# Altium schematic sheet MPU PWR.SchDoc
size A4; SheetNumber: 13; SheetTotal: 14
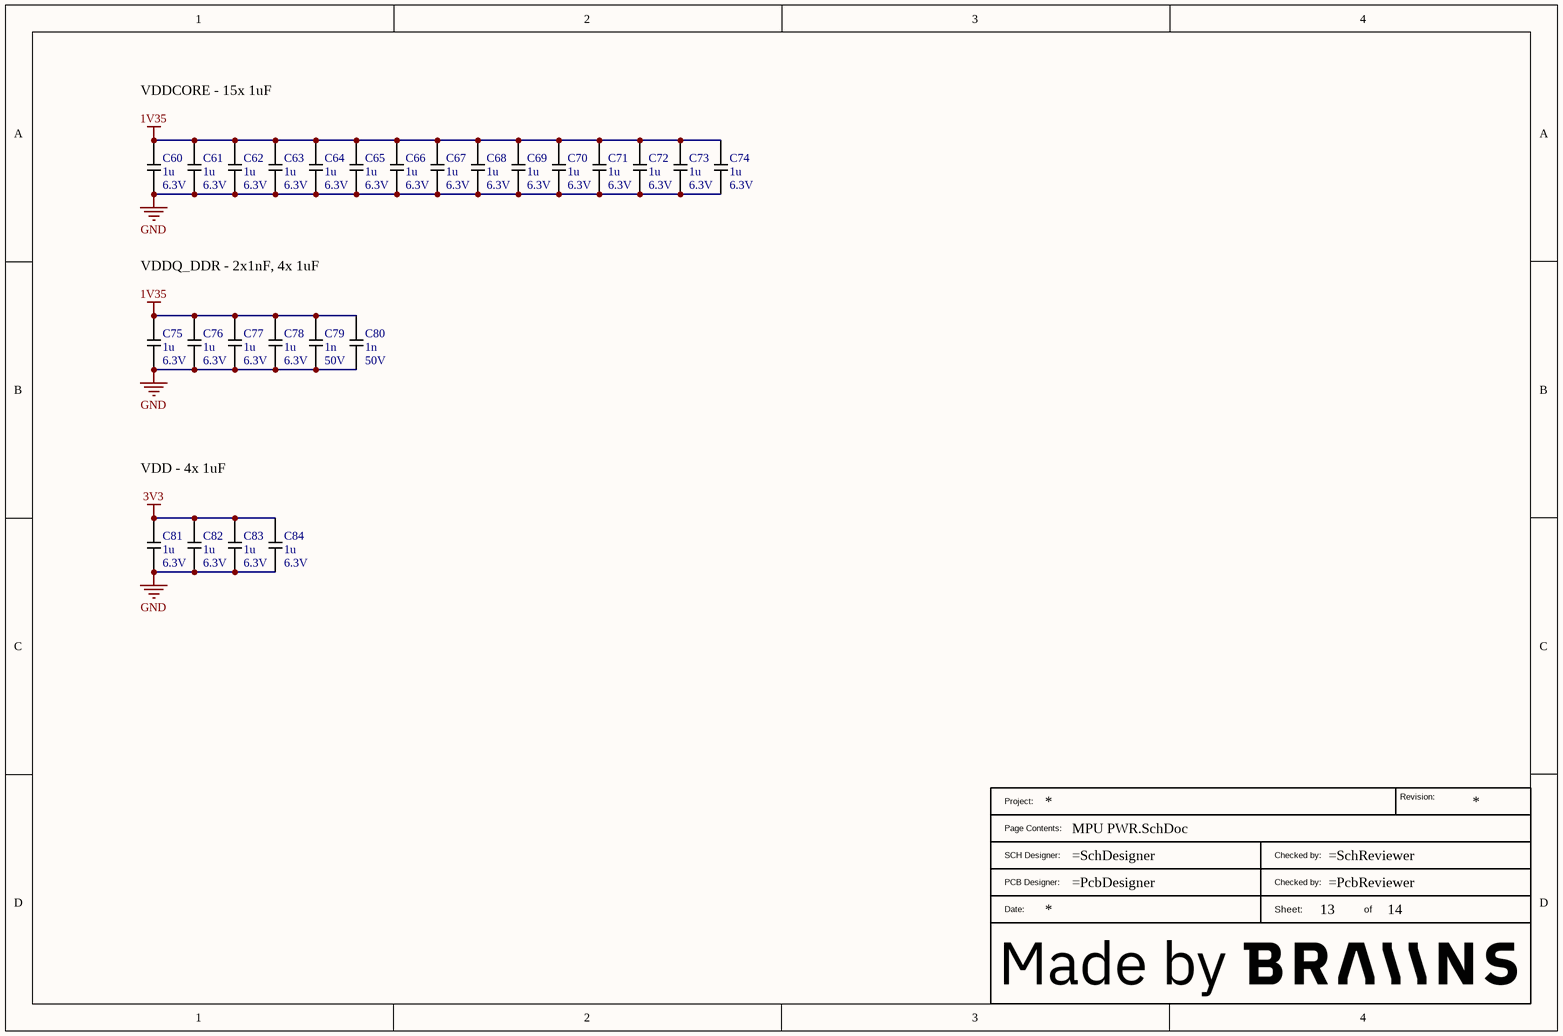
[diagram p0: MPU PWR.SchDoc]

## Parts
?  BraiinsTitleBlockWithLogo  (value not drawn)  (graphical)
C60  Voltage_Rating: 6.3V  [CAP0402]  (hidden comment: 1u)
C61  Voltage_Rating: 6.3V  [CAP0402]  (hidden comment: 1u)
C62  Voltage_Rating: 6.3V  [CAP0402]  (hidden comment: 1u)
C63  Voltage_Rating: 6.3V  [CAP0402]  (hidden comment: 1u)
C64  Voltage_Rating: 6.3V  [CAP0402]  (hidden comment: 1u)
C65  Voltage_Rating: 6.3V  [CAP0402]  (hidden comment: 1u)
C66  Voltage_Rating: 6.3V  [CAP0402]  (hidden comment: 1u)
C67  Voltage_Rating: 6.3V  [CAP0402]  (hidden comment: 1u)
C68  Voltage_Rating: 6.3V  [CAP0402]  (hidden comment: 1u)
C69  Voltage_Rating: 6.3V  [CAP0402]  (hidden comment: 1u)
C70  Voltage_Rating: 6.3V  [CAP0402]  (hidden comment: 1u)
C71  Voltage_Rating: 6.3V  [CAP0402]  (hidden comment: 1u)
C72  Voltage_Rating: 6.3V  [CAP0402]  (hidden comment: 1u)
C73  Voltage_Rating: 6.3V  [CAP0402]  (hidden comment: 1u)
C74  Voltage_Rating: 6.3V  [CAP0402]  (hidden comment: 1u)
C75  Voltage_Rating: 6.3V  [CAP0402]  (hidden comment: 1u)
C76  Voltage_Rating: 6.3V  [CAP0402]  (hidden comment: 1u)
C77  Voltage_Rating: 6.3V  [CAP0402]  (hidden comment: 1u)
C78  Voltage_Rating: 6.3V  [CAP0402]  (hidden comment: 1u)
C79  Voltage_Rating: 50V  [CAP0402]  (hidden comment: 1n)
C80  Voltage_Rating: 50V  [CAP0402]  (hidden comment: 1n)
C81  Voltage_Rating: 6.3V  [CAP0402]  (hidden comment: 1u)
C82  Voltage_Rating: 6.3V  [CAP0402]  (hidden comment: 1u)
C83  Voltage_Rating: 6.3V  [CAP0402]  (hidden comment: 1u)
C84  Voltage_Rating: 6.3V  [CAP0402]  (hidden comment: 1u)

## Nets
1V35: C60.1 C61.1 C62.1 C63.1 C64.1 C65.1 C66.1 C67.1 C68.1 C69.1 C70.1 C71.1 C72.1 C73.1 C74.1 C75.1 C76.1 C77.1 C78.1 C79.1 C80.1
3V3: C81.1 C82.1 C83.1 C84.1
GND: C60.2 C61.2 C62.2 C63.2 C64.2 C65.2 C66.2 C67.2 C68.2 C69.2 C70.2 C71.2 C72.2 C73.2 C74.2 C75.2 C76.2 C77.2 C78.2 C79.2 C80.2 C81.2 C82.2 C83.2 C84.2

## Notes on the sheet
- VDDCORE - 15x 1uF
- VDDQ_DDR - 2x1nF, 4x 1uF
- VDD - 4x 1uF
- (in symbol BraiinsTitleBlockWithLogo) Revision:; Project:; Page Contents:; SCH Designer:; Checked by:; PCB Designer:; Date:; Sheet:; of

## Library data of the parts
C60-C78 C81-C84 = 30155: CAP CER 1u 10% 6.3V X7R 0402; Part_Type: Capacitor; Part_Status: New; ID: 30155; Updated By: janjuranek; Sorted_Value: 1; Value: 1u; Sub_Type: CER; Manufacturer Part Description: CAP CER 1u 10% 6.3V X7R 0402; Package_Case: 0402; RoHS: Yes; Dielectric: X7R; Tolerance: 10%; Created By: janjuranek; Created_Date: 2023-05-01 19:24:23; Updated_Date: 2023-05-01 19:25:09; ComponentLink1Description: Datasheet; ComponentLink2Description: Supplier Part Details
C79 C80 = 30076: CAP CER 1n 10% 50V X7R 0402; Part_Type: Capacitor; Part_Status: New; ID: 30076; Updated By: Jan; Sorted_Value: 1; Value: 1n; Sub_Type: CER; Manufacturer Part Description: CAP CER 1n 10% 50V X7R 0402; Package_Case: 0402; RoHS: Yes; Temperature Range: -40 to +150C; Dielectric: X7R; Tolerance: 10%; Created By: Jan; Created_Date: 2023-03-02 13:25:54; Updated_Date: 2023-03-02 13:26:19; ComponentLink1Description: Datasheet; ComponentLink2Description: Supplier Part Details